# EAGLE design RasPi-BplusHAT_CamSlot (EAGLE 7.2.0)

## Sheet 1 of 2
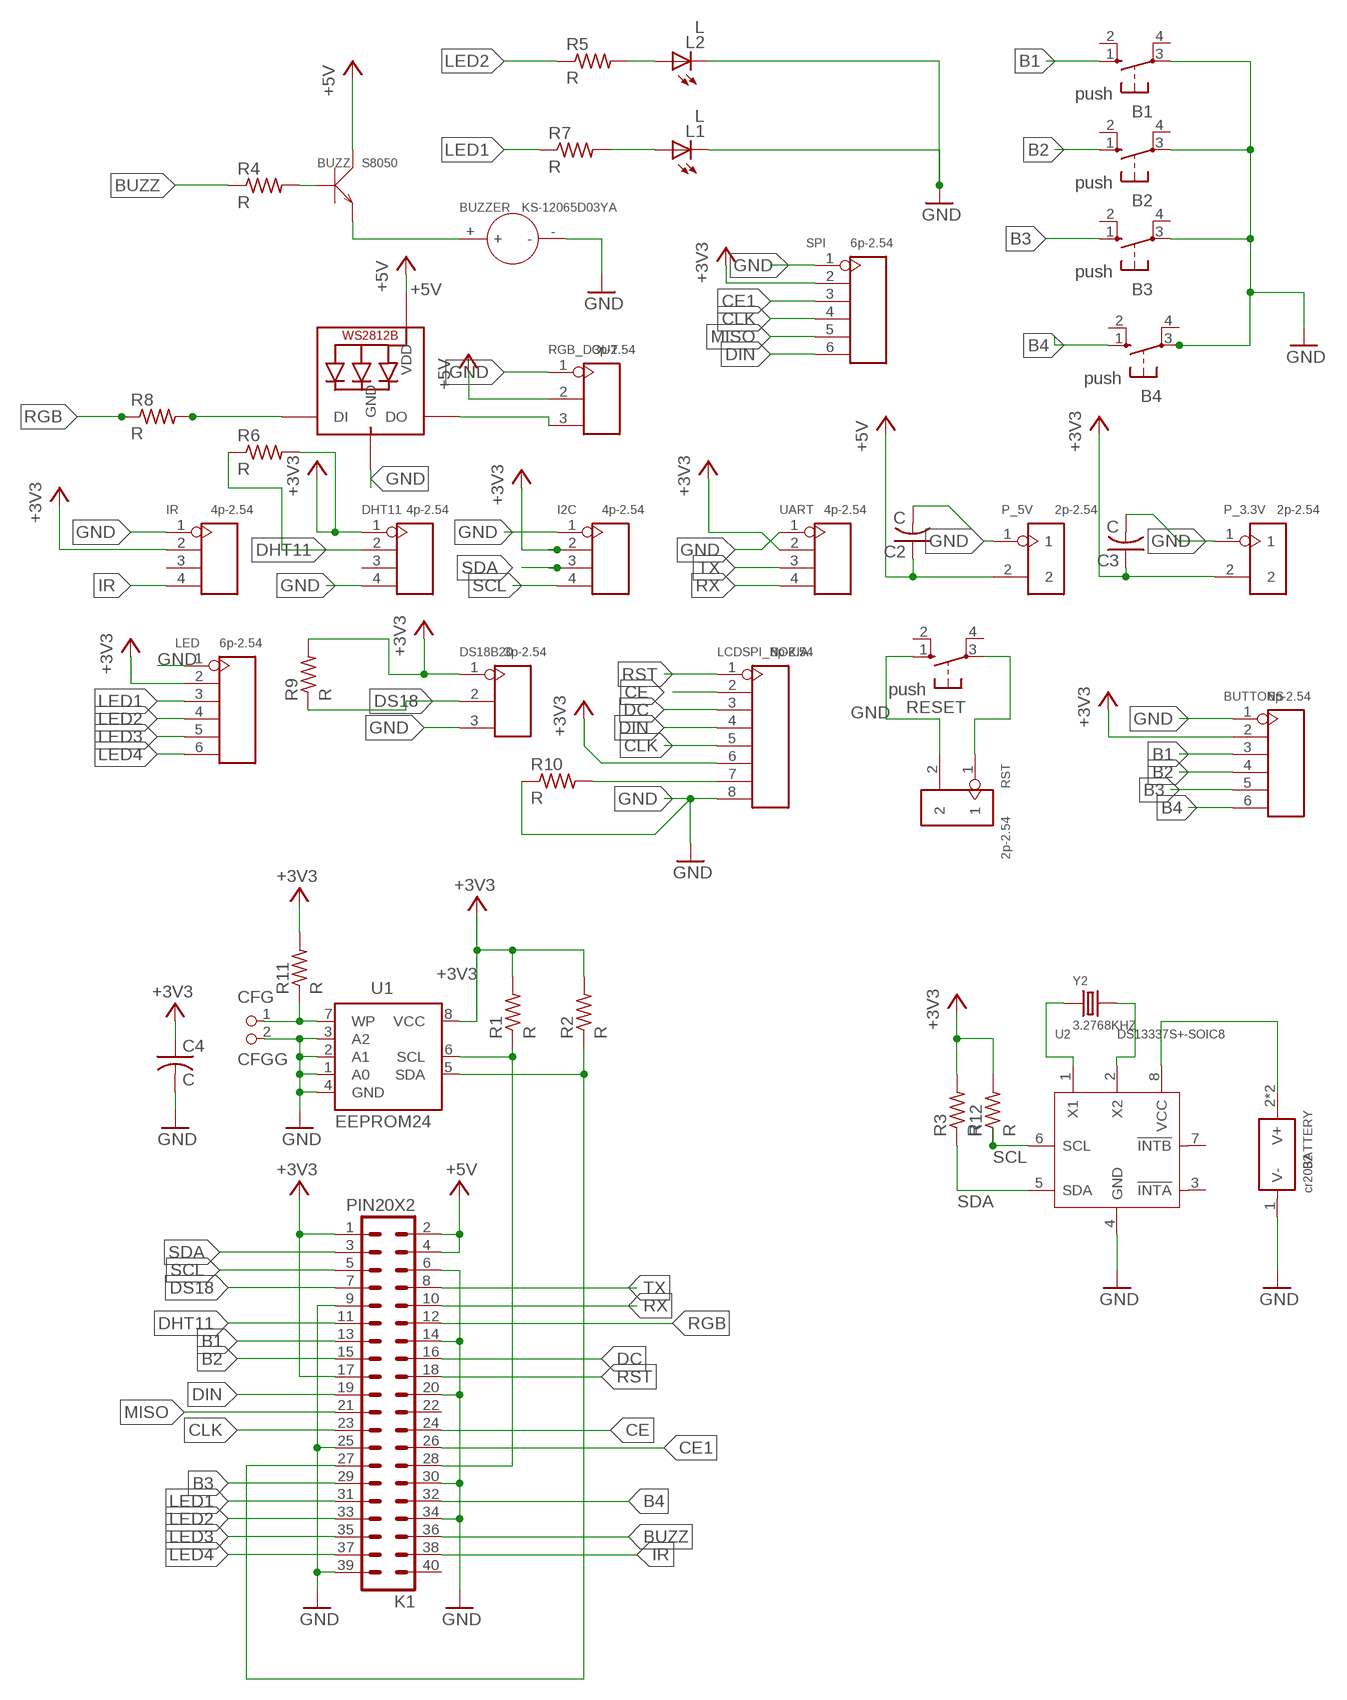
[diagram p0: schematic, sheet 1]

### Parts
B1  push  10-XX  [B3F-10XX]
B2  push  10-XX  [B3F-10XX]
B3  push  10-XX  [B3F-10XX]
B4  push  10-XX  [B3F-10XX]
BATTERY  cr2032  DIP-BATTERY-CELL-HOLDER(2032)  [BAT2P-20.32-CR2032]
BUTTONS  6p-2.54  DIP-BLACK-FEMALE-HEADER-VERT(6P-2.54)  [H6-2.54]
BUZZ  S8050  SMD-TRANSISTORS-NPN-25V-500MW-S8050(SOT-23)  [SOT-23]
BUZZER  KS-12065D03YA  DIP-BUZZER-3V(KS-12065D03YA)  [BZ2-7.6-D12.0XH6.5MM]
C2  C  C-USC1206  [C1206]
C3  C  C-USC1206  [C1206]
C4  C  C-USC1206  [C1206]
CFG  CFGG  PIN2_100  [PIN_W_2]
DHT11  4p-2.54  DIP-BLACK-FEMALE-HEADER-VERT(4P-2.54)  [H4-2.54]
DS18B20  3p-2.54  DIP-BLACK-MALE-HEADER-VERT(3P-2.54)  [H3-2.54]
I2C  4p-2.54  DIP-BLACK-FEMALE-HEADER-VERT(4P-2.54)  [H4-2.54]
IR  4p-2.54  DIP-BLACK-FEMALE-HEADER-VERT(4P-2.54)  [H4-2.54]
K1  PIN20X2  [PIN_20X2]
L1  L  LED5MM  [LED5MM]
L2  L  LED5MM  [LED5MM]
LCDSPI_NOKIA  8p-2.54  DIP-BLACK-FEMALE-HEADER-VERT(8P-2.54)  [H8-2.54]
LED  6p-2.54  DIP-BLACK-MALE-HEADER(6P-2.54)  [H6-2.54]
P_3.3V  2p-2.54  DIP-BLACK-MALE-HEADER-VERT(2P-2.54)  [H2-2.54]
P_5V  2p-2.54  DIP-BLACK-MALE-HEADER-VERT(2P-2.54)  [H2-2.54]
R1  R  R-US_M1206  [M1206]
R2  R  R-US_M1206  [M1206]
R3  R  R-US_M1206  [M1206]
R4  R  R-US_M1206  [M1206]
R5  R  R-US_M1206  [M1206]
R6  R  R-US_M1206  [M1206]
R7  R  R-US_M1206  [M1206]
R8  R  R-US_M1206  [M1206]
R9  R  R-US_M1206  [M1206]
R10  R  R-US_M1206  [M1206]
R11  R  R-US_M1206  [M1206]
R12  R  R-US_M1206  [M1206]
RESET  push  10-XX  [B3F-10XX]
RGB1  WS2812B_5050N  [WS2812B-NARROW]
RGB_DOUT  3p-2.54  DIP-BLACK-MALE-HEADER-VERT(3P-2.54)  [H3-2.54]
RST  2p-2.54  DIP-BLACK-MALE-HEADER-VERT(2P-2.54)  [H2-2.54]
SPI  6p-2.54  DIP-BLACK-FEMALE-HEADER-VERT(6P-2.54)  [H6-2.54]
U1  EEPROM24  [SOIC8]
U2  DS13337S+-SOIC8  CLOCK-DS1337S+(SOIC8)  [SOIC8-1.27-5X4MM]
UART  4p-2.54  DIP-BLACK-MALE-HEADER-VERT(4P-2.54)  [H4-2.54]
Y2  3.2768KHZ  SMD-CRYSTAL-32.768KHZ-12.5PF-20PPM-90K(2P-L2.0X1.2MM)  [X2-SMD-L2.0X1.2X0.55MM]

### Nets
+3V3: BUTTONS.2 C3.1 C4.1 DHT11.1 DS18B20.1 I2C.2 IR.2 K1.1 K1.17 LCDSPI_NOKIA.6 LED.2 P_3.3V.2 R1.2 R2.2 R3.2 R6.2 R9.2 R11.2 R12.2 SPI.2 U1.8(VCC) UART.2
+5V: BUZZ.3(C) C2.1 K1.2 K1.4 P_5V.2 RGB1.1-VDD(VDD) RGB_DOUT.2
B1: B1.1(S) BUTTONS.3 K1.13
B2: B2.1(S) BUTTONS.4 K1.15
B3: B3.1(S) BUTTONS.5 K1.29
B4: B4.1(S) BUTTONS.6 K1.32
BUZZ: K1.36 R4.1
CE: K1.24 LCDSPI_NOKIA.2
CE1: K1.26 SPI.3
CLK: K1.23 LCDSPI_NOKIA.5 SPI.4
DC: K1.16 LCDSPI_NOKIA.3
DHT11: DHT11.2 K1.11 R6.1
DI: R8.2 RGB1.4-DIN(DI)
DIN: K1.19 LCDSPI_NOKIA.4 SPI.6
DS18: DS18B20.2 K1.7 R9.1
GND: B1.3(P) B2.3(P) B3.3(P) B4.3(P) BATTERY.1(V-) BUTTONS.1 BUZZER.- C2.2 C3.2 C4.2 CFG.2 DHT11.4 DS18B20.3 I2C.1 IR.1 K1.6 K1.9 K1.14 K1.20 K1.25 K1.30 K1.34 K1.39 L1.K(C) L2.K(C) LCDSPI_NOKIA.8 LED.1 P_3.3V.1 P_5V.1 R10.1 RESET.1(S) RGB1.3-GND(GND) RGB_DOUT.1 RST.2 SPI.1 U1.1(A0) U1.2(A1) U1.3(A2) U1.4(GND) U2.4(GND) UART.1
IR: IR.4 K1.38
LED1: K1.31 LED.3 R7.1
LED2: K1.33 LED.4 R5.1
LED3: K1.35 LED.5
LED4: K1.37 LED.6
MISO: K1.21 SPI.5
N$1: K1.28 R1.1 U1.6(SCL)
N$2: K1.27 R2.1 U1.5(SDA)
N$3: CFG.1 R11.1 U1.7(WP)
N$4: BUZZ.2(E) BUZZER.+
N$5: L2.A R5.2
N$6: L1.A R7.2
N$7: RGB1.2-DOUT(DO) RGB_DOUT.3
N$9: BATTERY.2(V+) BATTERY.3(V+) U2.8(VCC)
N$11: RESET.3(P) RST.1
N$12: U2.1(X1) Y2.1
N$14: BUZZ.1(B) R4.2
N$15: U2.2(X2) Y2.2
N$18: LCDSPI_NOKIA.7 R10.2
RGB: K1.12 R8.1
RST: K1.18 LCDSPI_NOKIA.1
RX: K1.10 UART.4
SCL: I2C.4 K1.5 R12.1 U2.6(SCL)
SDA: I2C.3 K1.3 R3.1 U2.5(SDA)
TX: K1.8 UART.3
Unconnected: B1.2(S1) B1.4(P1) B2.2(S1) B2.4(P1) B3.2(S1) B3.4(P1) B4.2(S1) B4.4(P1) DHT11.3 IR.3 K1.22 K1.40 RESET.2(S1) RESET.4(P1) U2.3(!INTA!) U2.7(!INTB!)

## Sheet 2 of 2

## Library data of the parts
B1-B4 RESET = switch-omron:10-XX: OMRON SWITCH; MPN: B3F-1000; OC_FARNELL: 176432; OC_NEWARK: 36M3542
BATTERY = Seeed-OPL-Connector:DIP-BATTERY-CELL-HOLDER(2032): 320170003
BUTTONS SPI = Seeed-Connector -2016:DIP-BLACK-FEMALE-HEADER-VERT(6P-2.54): 320030060; MPN: F185-1106A1BSYC1
BUZZ = Seeed-Transistor-2016:SMD-TRANSISTORS-NPN-25V-500MW-S8050(SOT-23): 305010017; MPN: S8050
BUZZER = Seeed-Connector -2016:DIP-BUZZER-3V(KS-12065D03YA): 312010004; MPN: KS-12065D03YA
C2-C4 = adafruit:C-US: CAPACITOR, American symbol
CFG = FLYFISH:PIN2
DHT11 I2C IR = Seeed-Connector -2016:DIP-BLACK-FEMALE-HEADER-VERT(4P-2.54): 320030017; MPN: F185-1104A1BSYA1
DS18B20 RGB_DOUT = Seeed-Connector -2016:DIP-BLACK-MALE-HEADER-VERT(3P-2.54): 320020079
K1 = FLYFISH:PIN20X2
L1 L2 = adafruit:LED: LED OSRAM: - CHIPLED LG R971, LG N971, LY N971, LG Q971, LY Q971, LO R971, LY R971 LH N974, LH R974 LS Q976, LO Q976, LY Q976 LO Q996 - Hyper CHIPLED LW Q18S LB Q993, LB Q99A, LB R99A - SideLED LS A670, LO A670, LY A670, LG A670, LP A670 LB A673, LV A673, LT A673, LW A673 LH A674 LY A675 LS A676, LA A676, LO A676, LY A676, LW A676 LS A679, LY A679, LG A679 - Hyper Micro SIDELED® LS Y876, LA Y876, LO Y876, LY Y876 LT Y87S - SmartLED LW L88C, LW L88S LB L89C, LB L89S, LG L890 LS L89K, LO L89K, LY L89K LS L896, LA L896, LO L896, LY L896 - TOPLED LS T670, LO T670, LY T670, LG T670, LP T670 LSG T670, LSP T670, LSY T670, LOP T670, LYG T670 LG T671, LOG T671, LSG T671 LB T673, LV T673, LT T673, LW T673 LH T674 LS T676, LA T676, LO T676, LY T676, LB T676, LH T676, LSB T676, LW T676 LB T67C, LV T67C, LT T67C, LS T67K, LO T67K, LY T67K, LW E67C LS E67B, LA E67B, LO E67B, LY E67B, LB E67C, LV E67C, LT E67C LW T67C LS T679, LY T679, LG T679 LS T770, LO T770, LY T770, LG T770, LP T770 LB T773, LV T773, LT T773, LW T773 LH T774 LS E675, LA E675, LY E675, LS T675 LS T776, LA T776, LO T776, LY T776, LB T776 LHGB T686 LT T68C, LB T68C - Hyper Mini TOPLED® LB M676 - Mini TOPLED Santana® LG M470 LS M47K, LO M47K, LY M47K Source: http://www.osram.convergy.de/
LCDSPI_NOKIA = Seeed-Connector -2016:DIP-BLACK-FEMALE-HEADER-VERT(8P-2.54): 320030061; MPN: F185-1108A1BSYC1
LED = Seeed-Connector -2016:DIP-BLACK-MALE-HEADER(6P-2.54): 320020078; MPN: P125-1106A1BS116A1
P_3.3V P_5V RST = Seeed-Connector -2016:DIP-BLACK-MALE-HEADER-VERT(2P-2.54): 320020016; MPN: P125-1102A0BS116A1
R1-R12 = adafruit:R-US_: RESISTOR, American symbol
RGB1 = adafruit:WS2812B
U1 = FLYFISH:EEPROM24
U2 = Seeed-OPL-ic:CLOCK-DS1337S+(SOIC8): 310110008; MPN: DS1337S+
UART = Seeed-Connector -2016:DIP-BLACK-MALE-HEADER-VERT(4P-2.54): 320020017; MPN: P125-1104A0BS116A1
Y2 = Seeed-OPL-crystal-osctllator:SMD-CRYSTAL-32.768KHZ-12.5PF-20PPM-90K(2P-L2.0X1.2MM): 306010020; MPN: FC-12M

## Net classes
1 power: width 0.305 mm, drill 0.6 mm, clearance 0.305 mm

## Board
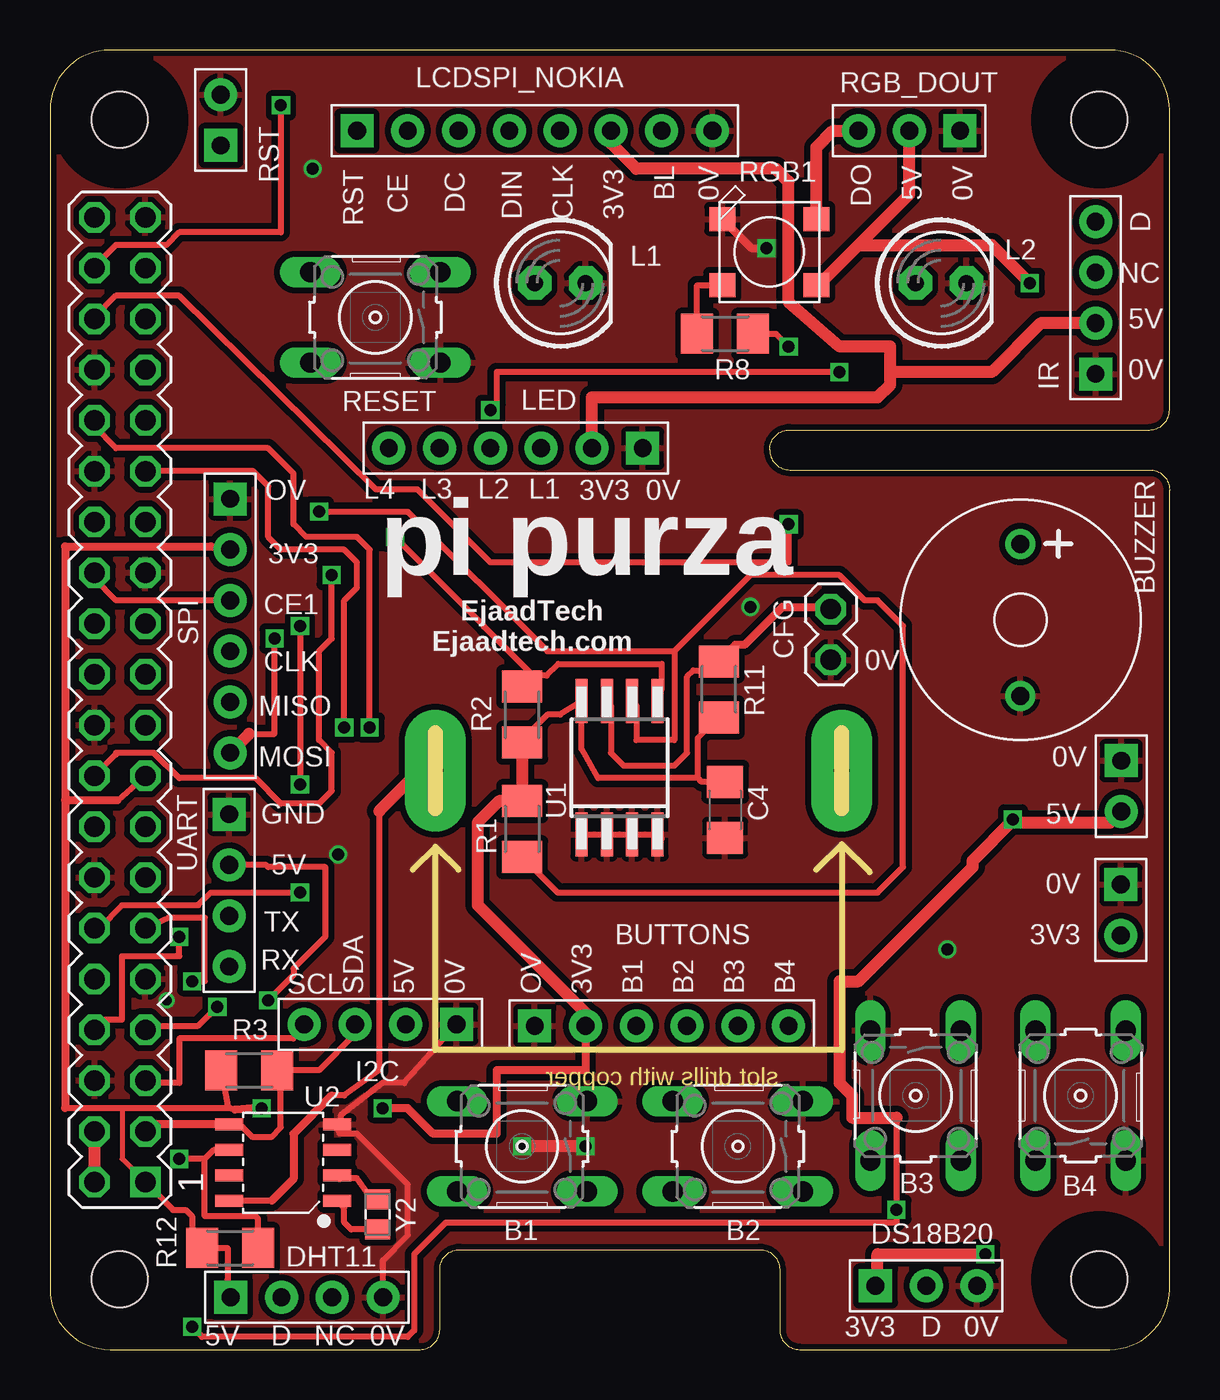
[diagram p1: board, top side]
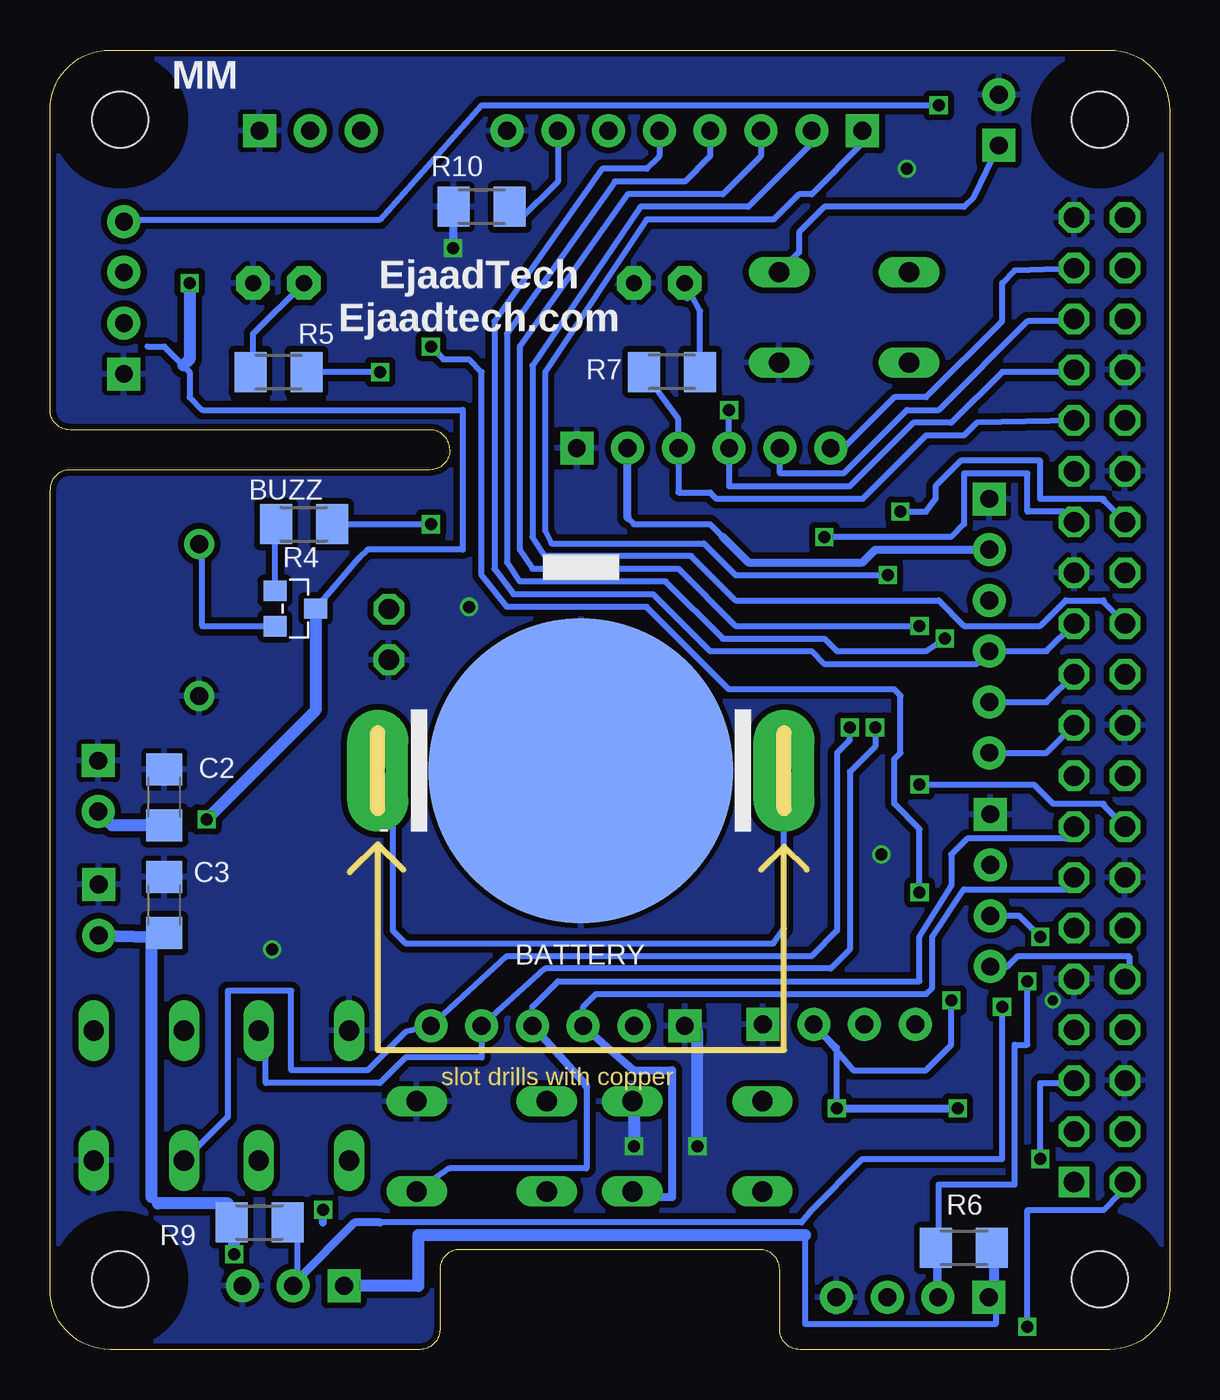
[diagram p2: board, bottom side, seen from below]

Size 56 x 65 mm. Coordinates in mm from the lower left corner, seen from the top.
Outline: 53,0 arc90 56,3 56,43 arc90 55,44 37,44 arc-90 36,45 arc-90 37,46 55,46 arc90 56,47 56,62 arc90 53,65 3,65 arc90 0,62 0,3 arc90 3,0 18.5,0 arc90 19.5,1 19.5,4 arc-90 20.5,5 35.5,5 arc-90 36.5,4 36.5,1 arc90 37.5,0 53,0
Copper layers (1*16): Top 0.035mm / dielectric 1.5mm / Bottom 0.035mm
Design rules "SeeedStudio_2layer_DRU_no_angle_20140221": minimum track width 6mil, minimum drill 12mil, track to track 6mil, track to pad 6mil, pad to pad 6mil, via to via 6mil, smd to smd 0mil, copper to edge 10mil, drill to drill 10mil, minimum pad ring 10mil, minimum via ring 6mil, stop-mask expansion 2mil, vias tented up to drill 100mil, thermal gap 10mil
Holes 2.8 mm at 52.5,3.5 3.5,3.5 3.5,61.5 52.5,61.5
tRestrict: area 1.9,2 to 5,5.1; area 1.9,60 to 5,63.1; area 50.9,60 to 54,63.1; area 50.9,2 to 54,5.1; area 69.8,1.9 to 72.9,5; area 69.8,59.9 to 72.9,63; area 118.8,59.9 to 121.9,63; area 118.8,1.9 to 121.9,5
bRestrict: area 50.9,2 to 54,5.1; area 1.9,2 to 5,5.1; area 50.9,60 to 54,63.1; area 1.9,60 to 5,63.1; area 118.8,1.9 to 121.9,5; area 69.8,1.9 to 72.9,5; area 118.8,59.9 to 121.9,63; area 69.8,59.9 to 72.9,63

### Footprints (pad centres in the part's own frame; a part is rotated, then mirrored left to right if it is on the bottom)
B3F-10XX = drill 1.016 long: 1 -3.251,2.261; 2 3.251,2.261; 3 -3.251,-2.261; 4 3.251,-2.261
BAT2P-20.32-CR2032 = smd 15.24 x 15.24: 1 0,0 | drill 0.762 pad 3.048 long: 2 -10.16,0; 3 10.16,0
H6-2.54 = drill 0.889 pad 1.651 square: 1 0,6.35 | drill 0.889 pad 1.651: 2 0,3.81; 3 0,1.27; 4 0,-1.27; 5 0,-3.81; 6 0,-6.35
SOT-23 = smd 1.016 x 1.143: 1 -0.889,-1.016; 2 0.889,-1.016; 3 0,1.016
BZ2-7.6-D12.0XH6.5MM = drill 0.9 pad 1.5: + -3.8,0; - 3.8,0
C1206 = smd 1.6 x 1.8: 1 -1.4,0; 2 1.4,0
PIN_W_2 = drill 1.016 octagon: 1 0,0; 2 0,-2.54
H4-2.54 = drill 0.889 pad 1.651 square: 1 0,3.81 | drill 0.889 pad 1.651: 2 0,1.27; 3 0,-1.27; 4 0,-3.81
H3-2.54 = drill 0.889 pad 1.651 square: 1 0,2.54 | drill 0.889 pad 1.651: 2 0,0; 3 0,-2.54
PIN_20X2 = drill 1.016 square: 1 -24.13,-1.27 | drill 1.016 octagon: 2 -24.13,1.27; 3 -21.59,-1.27; 4 -21.59,1.27; 5 -19.05,-1.27; 6 -19.05,1.27; 7 -16.51,-1.27; 8 -16.51,1.27; 9 -13.97,-1.27; 10 -13.97,1.27; 11 -11.43,-1.27; 12 -11.43,1.27; 13 -8.89,-1.27; 14 -8.89,1.27; 15 -6.35,-1.27; 16 -6.35,1.27; 17 -3.81,-1.27; 18 -3.81,1.27; 19 -1.27,-1.27; 20 -1.27,1.27; 21 1.27,-1.27; 22 1.27,1.27; 23 3.81,-1.27; 24 3.81,1.27; 25 6.35,-1.27; 26 6.35,1.27; 27 8.89,-1.27; 28 8.89,1.27; 29 11.43,-1.27; 30 11.43,1.27; 31 13.97,-1.27; 32 13.97,1.27; 33 16.51,-1.27; 34 16.51,1.27; 35 19.05,-1.27; 36 19.05,1.27; 37 21.59,-1.27; 38 21.59,1.27; 39 24.13,-1.27; 40 24.13,1.27
LED5MM = drill 0.813 pad 1.676 octagon: A -1.27,0; K 1.27,0
H8-2.54 = drill 0.889 pad 1.651 square: 1 0,8.89 | drill 0.889 pad 1.651: 2 0,6.35; 3 0,3.81; 4 0,1.27; 5 0,-1.27; 6 0,-3.81; 7 0,-6.35; 8 0,-8.89
H2-2.54 = drill 0.889 pad 1.651 square: 1 0,1.27 | drill 0.889 pad 1.651: 2 0,-1.27
M1206 = smd 1.6 x 2: 1 -1.4,0; 2 1.4,0
WS2812B-NARROW = smd 1.3 x 1.2: 1-VDD 2.35,-1.65; 2-DOUT 2.35,1.65; 3-GND -2.35,1.65; 4-DIN -2.35,-1.65
SOIC8 = smd 0.6 x 2.2: 1 -1.905,-3.33; 2 -0.635,-3.33; 3 0.635,-3.33; 4 1.905,-3.33; 5 1.905,3.33; 6 0.635,3.33; 7 -0.635,3.33; 8 -1.905,3.33
SOIC8-1.27-5X4MM = smd 0.6 x 1.4: 1 -1.905,-2.7; 2 -0.635,-2.7; 3 0.635,-2.7; 4 1.905,-2.7; 5 1.905,2.7; 6 0.635,2.7; 7 -0.635,2.7; 8 -1.905,2.7
X2-SMD-L2.0X1.2X0.55MM = smd 1 x 1.25: 1 -0.75,0; 2 0.75,0

### Placement (x,y rotation side)
B1  23.61,10.16 180 top
B2  34.41,10.16 180 top
B3  43.3,12.7 270 top
B4  51.55,12.7 90 top
BATTERY  29.44,28.96 0 bottom
BUTTONS  30.6,16.19 90 top
BUZZ  43.73,37.06 270 bottom
BUZZER  48.54,36.49 270 top
C2  50.28,27.62 90 bottom
C3  50.28,22.23 90 bottom
C4  33.77,26.99 270 top
CFG  39.06,37.04 0 top
DHT11  12.85,2.62 90 top
DS18B20  43.83,3.19 90 top
I2C  16.53,16.27 270 top
IR  52.3,52.61 180 top
K1  3.5,32.5 90 top
L1  25.52,53.34 0 top
L2  44.57,53.34 0 top
LCDSPI_NOKIA  24.25,60.96 90 top
LED  23.3,45.09 270 top
P_3.3V  53.57,21.99 0 top
P_5V  53.59,28.18 0 top
R1  23.61,26.04 90 top
R2  23.61,31.75 270 top
R3  9.96,13.97 180 top
R4  43.3,41.28 180 bottom
R5  44.57,48.9 180 bottom
R6  10.28,5.08 0 bottom
R7  24.88,48.9 0 bottom
R8  33.77,50.8 180 top
R9  45.52,6.35 180 bottom
R10  34.41,57.15 0 bottom
R11  33.46,33.02 270 top
R12  9.01,5.08 180 top
RESET  16.28,51.63 180 top
RGB1  35.98,54.9 0 top
RGB_DOUT  42.98,60.96 270 top
RST  8.54,61.5 180 top
SPI  9.01,36.2 0 top
U1  28.49,29.1 0 top
U2  11.67,9.35 90 top
UART  8.96,22.96 0 top
Y2  16.4,6.76 90 top

### Tracks (layer width: path | path; a pad name or v marks a point on that pad's centre or on a via)
+3V3  (via drill 0.6)
  Top 0.254: 3.61,12.07 3.61,9.53 K1.1
  Top 0.305: 9.26,12 9.01,12.07 | 9.01,12.07 3.61,12.07 0.75,12.07 | K1.17 3.38,27.47 | 32.41,28.58 27.42,28.58 26.58,30.05 U1.8 26.54,32.39 25.52,31.75 24.88,31.75 23.61,30.48 R2.2 | v10.91,17.46 12.18,18.73 12.18,19.05 13.77,20.64 13.77,24.13 10.91,24.13 10.81,24.23 UART.2 | 32.41,28.58 32.41,30.58 R11.2 | C4.1 32.6,28.39 32.41,28.58 | R3.2 8.88,12.2 9.01,12.07 | 7.1,4.58 R12.2 | DS18B20.1 41.39,2.86 | R12.2 R6.2 8.88,3.49 DHT11.1 | K1.1 5.83,7.3 6.15,6.99 6.79,6.99 7.1,6.67 7.1,5.08 R12.2
  Top 0.406: 3.38,27.47 0.75,27.47 | 0.75,27.47 0.75,12.07 | 0.75,27.47 0.75,40.17 8.06,40.17 SPI.2 | BUTTONS.2 26.79,13.97 22.34,13.97 22.34,10.8 19.17,10.8 17.9,12.07 v16.63,12.07 | v10.6,12.07 10.14,12.07 9.26,12
  Top 0.61: LED.2 27.11,47.63 41.39,47.63 42.03,48.26 42.03,48.9 | 42.03,48.9 42.03,50.17 39.49,50.17 36.95,52.39 36.95,58.42 36.31,59.06 29.33,59.06 28.06,60.33 LCDSPI_NOKIA.6 | BUTTONS.2 26.79,16.83 21.39,22.23 21.39,26.35 22.47,27.44 R1.2 R2.2 | IR.2 49.55,51.34 47.11,48.9 42.03,48.9 | 41.39,2.86 41.39,4.76 v46.79,4.76
  Bottom 0.305: 27.11,41.59 26.79,41.28 22.98,41.28 22.34,40.64 | v10.91,17.46 10.91,15.24 12.18,13.97 15.82,13.97 I2C.2 16.63,15.1 v16.63,12.07 | DHT11.1 8.88,2.14 R6.2 8.69,5.08 8.69,1.27 18.22,1.27 18.22,5.72 | 46.79,6.03 R9.2 47.11,7.3 | 50.6,7.3 50.92,7.62 | 50.92,20.96 50.92,20.64 C3.1
  Bottom 0.406: 22.34,40.64 21.07,39.37 15.36,39.37 14.72,40.01 SPI.2 | 27.11,41.59 LED.2 | v16.63,12.07 v10.6,12.07
  Bottom 0.61: 18.22,5.72 37.58,5.72 37.58,3.18 DS18B20.1 | v46.79,4.76 46.79,6.03 | 47.11,7.3 50.6,7.3 | 50.92,7.62 50.92,20.64 P_3.3V.2
+5V  (via drill 0.6)
  Top 0.305: 42.35,11.59 v42.35,6.99 42.35,6.35 19.8,6.35 18.22,4.76 18.22,0.95 17.9,0.64 7.61,0.64 v7.1,1.14
  Top 0.406: 2.23,8.05 K1.2
  Top 0.61: K1.2 K1.4 | 42.35,11.59 40.12,11.59 40.12,12.7 39.49,13.34 39.49,18.42 40.44,18.42 46.16,24.13 46.16,24.45 48.22,26.51 | 48.22,26.51 v48.17,26.51 | 48.22,26.51 48.38,26.35 53.03,26.35 P_5V.2 | 40.44,55.25 42.98,57.79 RGB_DOUT.2 | RGB1.1-VDD 38.44,53.25 40.44,55.25 | 40.44,55.25 47.11,55.25 v49.01,53.34
  Bottom 0.305: 51.13,50.17 50.28,50.17 49.33,49.21 49.01,48.9 49.01,47.63 48.38,46.99 35.36,46.99 35.36,40.01 40.12,40.01 40.53,39.6 BUZZ.3 | v7.1,1.14 7.1,6.99 3.29,6.99 2.5,7.78 2.5,8.1 K1.2
  Bottom 0.406: 42.35,6.35 v42.35,6.99
  Bottom 0.61: BUZZ.3 42.71,31.97 v48.17,26.51 | C2.1 52.9,26.22 P_5V.2 | v49.01,53.34 49.01,49.53 49.33,49.21
B1
  Bottom 0.305: BUTTONS.3 29.33,17.15 28.69,17.78 12.18,17.78 11.87,18.1 11.87,20.64 10.28,23.02 5.2,23.02 K1.13
  Bottom 0.406: BUTTONS.3 26.79,13.97 24.88,13.97 24.88,7.62 26.51,7.62 B1.1
B2
  Bottom 0.305: 29.17,13.18 29.17,9.05 36.04,9.05 B2.1 | BUTTONS.4 31.87,17.15 30.6,18.42 12.5,18.42 12.5,20.64 10.91,23.18 10.91,24.77 10.12,25.56 5.2,25.56 K1.15
  Bottom 0.406: BUTTONS.4 29.17,13.18
B3  (via drill 0.6)
  Top 0.305: v14.72,31.12 14.72,37.47 15.36,38.1 15.36,39.37 14.72,40.01 11.55,40.01 10.91,40.64 10.91,43.18 10.16,43.93 K1.29
  Bottom 0.305: B3.1 45.2,15.6 45.2,13.34 39.49,13.34 38.22,14.61 34.41,14.61 BUTTONS.5 31.23,19.05 16.95,19.05 15.99,20 15.99,28.89 14.72,30.16 v14.72,31.12
B4  (via drill 0.6)
  Top 0.305: v15.99,31.12 15.99,40.01 15.36,40.64 12.82,40.64 12.18,41.28 12.18,43.82 10.91,45.09 3.29,45.09 2.23,46.15 K1.32
  Bottom 0.305: B4.1 47.11,11.63 47.11,17.94 43.93,17.94 43.93,13.97 40.12,13.97 38.22,15.88 BUTTONS.6 33.14,19.69 17.9,19.69 16.63,20.96 16.63,29.85 15.99,30.48 v15.99,31.12
BUZZ  (via drill 0.6)
  Top 0.305: v36.95,41.28 36.95,39.37 22.03,39.37 18.38,43.02 16.31,43.02 6.47,52.71 3.29,52.71 2.23,51.64 K1.36
  Bottom 0.305: R4.1 v36.95,41.28
CE
  Bottom 0.305: LCDSPI_NOKIA.2 17.9,60.33 21.07,57.15 26.47,57.15 31.87,49.21 31.87,40.64 31.23,39.69 23.93,39.69 21.71,37.47 11.55,37.47 10.28,36.2 6.47,36.2 5.2,37.47 3.29,37.47 3.29,37.38 K1.24
CE1
  Top 0.305: SPI.3 3.29,37.47 2.23,38.53 K1.26
CLK
  Bottom 0.305: K1.23 6.15,34.93 SPI.4 9.64,34.29 17.26,34.29 17.9,34.93 22.98,34.93 25.84,37.78 32.82,37.78 33.77,39.05 33.77,51.44 28.38,59.06 26.15,59.06 25.52,59.69 LCDSPI_NOKIA.5
DC  (via drill 0.6)
  Top 0.305: v12.5,36.2 v12.5,28.26
  Bottom 0.305: LCDSPI_NOKIA.3 20.44,59.69 22.34,57.79 27.11,57.79 32.5,50.17 32.5,40.01 31.87,39.05 24.57,39.05 21.71,36.2 v12.5,36.2 | v12.5,28.26 6.79,28.26 5.83,27.31 3.29,27.31 3.29,27.22 K1.16
DHT11  (via drill 0.6)
  Top 0.305: v7.1,18.42 7.74,18.42 7.74,21.59 5.92,21.59 K1.11
  Bottom 0.305: v7.1,18.42 7.1,15.24 7.74,15.24 7.74,8.26 11.55,8.26 11.55,1.98 DHT11.2 11.68,2.09 R6.1
DI
  Top 0.305: R8.2 32.37,53.23 RGB1.4-DIN
DIN  (via drill 0.6)
  Top 0.305: 9.96,30.8 11.23,30.8 v11.23,35.56
  Top 0.61: SPI.6 9.96,30.8
  Bottom 0.305: SPI.6 6.15,29.85 K1.19 | LCDSPI_NOKIA.4 22.98,59.69 24.25,58.42 27.74,58.42 33.14,50.8 33.14,39.37 32.5,38.42 25.2,38.42 22.34,35.56 17.26,35.56 16.63,34.93 12.18,34.93 v11.23,35.56
DS18  (via drill 0.6)
  Top 0.305: K1.7 5,15.99 5.2,16.19 7.42,16.19 v8.37,17.15
  Bottom 0.305: v8.37,17.15 8.37,9.53 15.36,9.53 17.9,6.99 18.41,6.35 39.49,6.35 | 43.62,3.81 43.62,6.03 R9.1
  Bottom 0.406: 39.49,6.35 40.76,6.35 43.62,3.49 | DS18B20.2 43.93,2.97 43.93,3.18 43.62,3.49 | 43.62,3.81 43.62,3.49
GND  (via drill 0.5, 0.6)
  Top 0.305: 14.51,10.8 14.57,11.75 16.63,13.34 17.72,13.34 I2C.1 | U1.1 U1.2 U1.3 U1.4 30.6,25.56 | DHT11.4 16.66,4.47 17.9,5.72 17.9,8.26 15.36,10.8 14.51,10.8 | 14.51,10.8 U2.4
  Top 0.406: RGB1.3-GND 35.09,55.09 v35.84,55.09
  Top 0.61: v26.79,10.16 v23.61,10.16
  Bottom 0.406: v35.84,55.09 35.81,55.12 R10.1
  Bottom 0.61: B1.3 26.79,12.35 v26.79,10.16 | v23.61,10.16 23.61,15.88 BUTTONS.1
  other vias: 13.14,59.06 14.41,24.77 44.89,20 5.83,17.46 35.04,37.15
  pour Bottom (isolate 0.305): 1.07,65.72 56.63,65.72 56.63,65.41 57.27,65.41 57.27,-0.95 -1.79,-0.95 -2.74,-0.95 -2.74,65.72
  pour Top (isolate 0.305): -6.07,52.19 -6.07,66.49 -4.07,68.49 63.03,68.49 65.83,65.69 65.83,-3.61 60.93,-8.51 -2.87,-8.51 -5.17,-6.21 -5.17,50.99
IR  (via drill 0.6)
  Top 0.305: v11.55,62.23 11.55,55.88 6.47,55.88 5.83,55.25 3.29,55.25 2.23,54.18 K1.38
  Bottom 0.305: IR.4 52.19,56.52 39.49,56.52 34.41,62.23 v11.55,62.23
LED1
  Bottom 0.305: R7.1 24.57,46.54 LED.3 24.57,42.86 22.98,42.86 22.66,42.55 15.36,42.55 12.18,45.72 10.28,45.72 9.64,46.36 K1.31
LED2  (via drill 0.6)
  Top 0.305: v39.49,48.9 22.34,48.9 22.34,47.31 v22.03,46.99
  Bottom 0.305: K1.33 4.56,48.9 8.37,48.9 10.91,46.36 12.82,46.36 15.99,43.18 22.03,43.18 LED.4 v22.03,46.99 | v39.49,48.9 R5.1
LED3
  Bottom 0.305: LED.5 19.49,43.82 16.31,43.82 13.14,46.99 11.55,46.99 7.1,51.44 4.56,51.44 K1.35
LED4
  Bottom 0.305: K1.37 7.74,53.98 8.37,53.34 8.37,51.44 12.18,47.63 13.77,47.63 16.31,45.09 LED.6
MISO
  Bottom 0.305: SPI.5 6.15,32.39 K1.21
N$1  (via drill 0.6)
  Top 0.305: v13.45,41.91 17.9,41.91 24.88,34.93 31.23,34.93 | 31.23,34.93 31.23,30.48 29.33,30.48 29.33,32.22 U1.6 | 31.23,34.93 35.04,38.74 39.49,38.74 40.76,37.47 41.39,37.47 42.66,36.2 42.66,24.13 41.39,22.86 25.39,22.86 R1.1
  Bottom 0.305: K1.28 3.29,42.46 3.29,42.55 6.47,42.55 6.47,44.45 10.44,44.45 11.71,43.18 11.71,42.55 12.18,41.91 v13.45,41.91
N$2  (via drill 0.6)
  Top 0.305: v17.26,40.64 21.71,36.2 21.71,36.15 24.16,33.7 | 24.16,33.7 24.84,33.7 25.43,34.29 30.6,34.29 30.6,33.02 30.39,32.82 U1.5 | 24.16,33.7 R2.1
  Bottom 0.305: K1.27 5.29,41.91 7.1,41.91 7.1,43.82 10.28,43.82 10.28,41.28 10.91,40.64 v17.26,40.64
N$3
  Top 0.305: U1.7 28.06,32.22 28.06,29.85 28.69,29.21 31.23,29.21 31.87,29.85 31.87,33.66 32.19,33.97 33.01,33.97 R11.1
  Top 0.406: CFG.1 38.94,37.15 36.63,37.15 34.73,35.24 34.28,35.24 R11.1
N$4
  Bottom 0.305: BUZZ.2 48.36,36.17 48.38,36.2 48.38,40.13 BUZZER.+
N$5
  Bottom 0.305: R5.2 45.97,49.4 45.84,49.53 45.84,50.8 L2.A
N$6
  Bottom 0.305: 24.12,52.58 L1.A 23.48,51.94 R7.2
N$7
  Top 0.61: RGB1.2-DOUT 38.33,60.12 39.17,60.96 RGB_DOUT.3
N$9
  Top 0.305: 16.47,26.94 16.47,13.97 14.72,12.7 14.09,12.7 | 11.09,7.44 U2.8
  Top 0.406: 14.09,12.7 12.18,10.8 12.18,8.54 11.09,7.44
  Top 0.61: BATTERY.3 18.49,28.96 16.47,26.94
  Bottom 0.305: BATTERY.2 38.85,28.84 38.85,20.96 38.22,20.32 19.8,20.32 19.28,21.07 BATTERY.3
N$11
  Bottom 0.305: 19.17,53.89 RESET.3 18.53,54.88 18.53,55.88 17.26,57.15 10.28,57.15 9.79,57.64 RST.1
N$12
  Top 0.305: Y2.1 15.06,6.01 14.72,6.35 14.72,7.09 U2.1
N$14
  Bottom 0.305: BUZZ.1 44.75,41.87 R4.2
N$15
  Top 0.305: Y2.2 16.1,7.51 15.36,8.57 14.51,8.57
  Top 0.406: 14.51,8.57 U2.2
N$18
  Bottom 0.305: LCDSPI_NOKIA.7 30.6,58.42 32.5,56.52 32.5,56.65 R10.2
RGB  (via drill 0.6)
  Top 0.305: K1.12 2.46,21.07 3.61,22.23 7.42,22.23 8.06,22.86 v12.5,22.86 | R8.1 36.31,50.8 v36.95,50.17
  Bottom 0.305: v12.5,22.86 12.5,26.04 13.77,27.31 13.77,29.53 13.45,29.85 13.45,32.7 13.77,33.02 22.03,33.02 26.15,37.15 33.14,37.15 34.41,38.74 34.41,48.9 35.04,49.53 36.31,49.53 v36.95,50.17
RST  (via drill 0.6)
  Top 0.305: K1.18 3.29,29.76 3.29,29.85 5.2,29.85 6.47,28.58 10.28,28.58 11.55,27.31 13.45,27.31 14.09,27.94 14.09,29.85 13.45,30.48 13.45,34.93 14.09,35.56 v14.09,38.74
  Bottom 0.305: LCDSPI_NOKIA.1 15.36,60.33 17.9,57.79 18.53,57.79 19.8,56.52 26.15,56.52 31.23,48.9 31.23,40.96 30.92,40.32 23.3,40.32 21.71,38.74 v14.09,38.74
RX
  Bottom 0.305: UART.4 8.12,19.15 7.58,19.69 2.02,19.69 2.02,18.74 K1.10
SCL  (via drill 0.6)
  Top 0.305: K1.5 4.88,13.34 6.47,13.34 6.47,15.56 12.18,15.56 12.26,15.95 I2C.4 | 6.61,9.67 v6.47,9.53 7.74,9.53 | R12.1 10.41,6.54 10.28,6.67 7.74,6.67 7.74,9.53 | U2.6 8.2,9.98 7.74,9.53
  Bottom 0.305: v6.47,9.53 6.47,13.34 4.88,13.34 K1.5
SDA
  Top 0.305: I2C.3 15.26,15.78 13.45,13.97 R3.1 11.55,13.52 11.55,11.11 11.05,10.62 10.14,10.62 9.64,11.11 9.11,11.11 U2.5
  Top 0.406: U2.5 4.79,11.25 K1.3
TX  (via drill 0.6)
  Top 0.305: K1.8 2.75,16.51 3.61,16.51 3.61,19.69 6.47,19.69 v6.47,20.64
  Bottom 0.305: v6.47,20.64 7.52,21.69 UART.3

### Text on the board
tNames: CE | DC | BL | 0V | DO | 5V | 0V | RST | DIN | CLK | 3V3 | D | NC | 5V | 0V | OV | 3V3 | 0V | L4 | L3 | L2 | L1 | 3V3 | pi purza | CE1 | EjaadTech / Ejaadtech.com | CLK | 0V | MISO | MOSI | 0V | GND | 5V | 5V | 0V | TX | 3V3 | RX | SCL | SDA | 5V | 0V | OV | 3V3 | B1 | B2 | B3 | B4 | 5V | D | NC | 0V | 3V3 | D | 0V
bNames: MM | EjaadTech / Ejaadtech.com